# Altium project BatteryCounterRX.PrjPcb
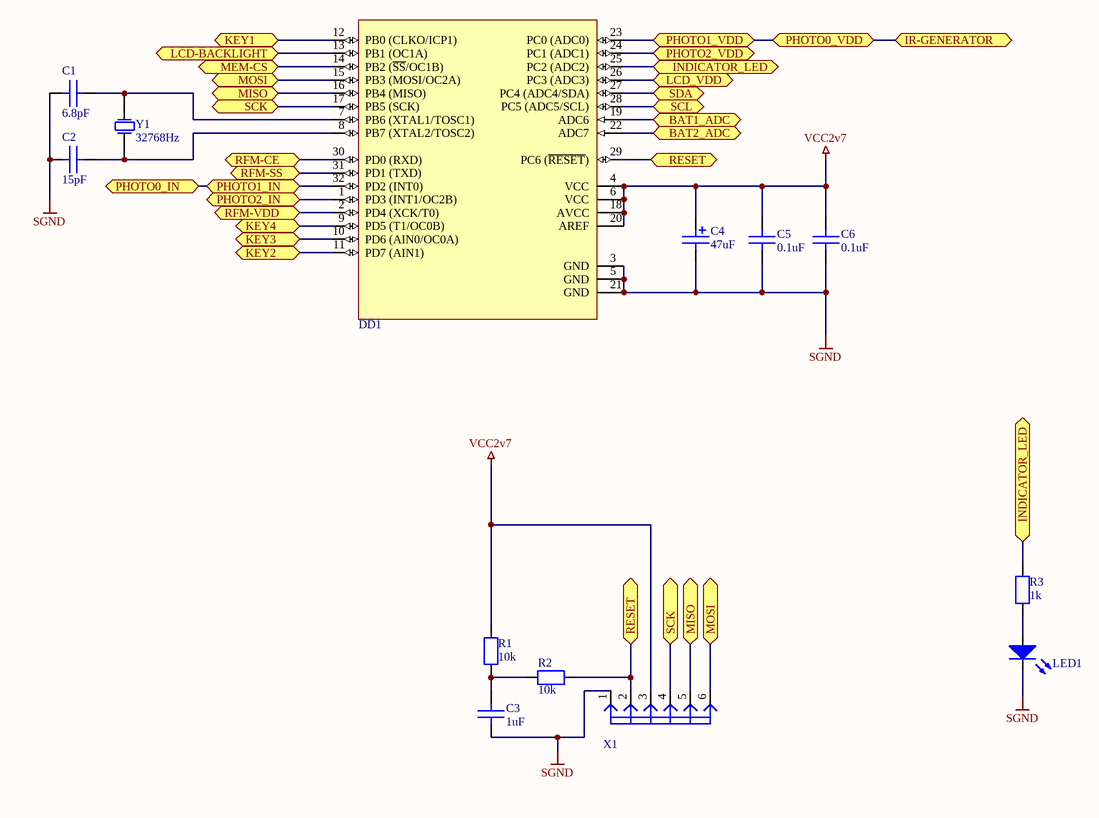
[diagram p0: Micro.SchDoc]
8 sheets, 91 parts. Net scope: global (net labels, ports and power ports of the same name join across sheets).
Board file: BatteryCounterRX.PcbDoc
Sheets:
  Micro.SchDoc
  BattPower.SchDoc
  Memory.SchDoc
  PhotoSensors.SchDoc
  IRGenerator.SchDoc
  KeyBoard.SchDoc
  LCDDisplay.SchDoc
  RFTransceiver.SchDoc

## Sheet Micro.SchDoc
size A4

### Parts
C1  value 6.8pF  [C0805]  (hidden comment: C6.8pF-50V-10%)
C2  value 15pF  [C0805]  (hidden comment: C15pF-50V-10%)
C3  value 1uF  [C0805]  (hidden comment: C1uF-50V)
C4  value 47uF  [TC2917]  (hidden comment: C47uF-10V-tant)
C5  value 0.1uF  [C0805]  (hidden comment: C0.1uF-50V)
C6  value 0.1uF  [C0805]  (hidden comment: C0.1uF-50V)
DD1  ATmega328P  [32A_N]  (value not drawn)
LED1  LED-RED  [LED-3]  (value not drawn)
R1  value 10k  [R0805]  (hidden comment: R10k-5%)
R2  value 10k  [R0805]  (hidden comment: R10k-5%)
R3  value 1k  [R0805]  (hidden comment: R1k-5%)
X1  PLS-6  [PLS-6]  (value not drawn)
Y1  value 32768Hz  [KX38]  (hidden comment: XTAL32768Hz)

### Ports
BAT1_ADC, BAT2_ADC, INDICATOR_LED, IR-GENERATOR, KEY1, KEY2, KEY3, KEY4, LCD-BACKLIGHT, LCD_VDD, MEM-CS, MISO, MOSI, PHOTO0_IN, PHOTO0_VDD, PHOTO1_IN, PHOTO1_VDD, PHOTO2_IN, PHOTO2_VDD, RESET, RFM-CE, RFM-SS, RFM-VDD, SCK, SCL, SDA

### Nets
SGND: C1.1 C2.1 C3.1 C4.2 C5.1 C6.1 DD1.3(GND) DD1.5(GND) DD1.21(GND) LED1.2(K) X1.1
VCC2v7: C4.1 C5.2 C6.2 DD1.4(VCC) DD1.6(VCC) DD1.18(AVCC) DD1.20(AREF) R1.2 X1.3
NetC1_2: C1.2 DD1.7(PB6_(XTAL1/TOSC1)) Y1.2(OSC2)
NetC2_2: C2.2 DD1.8(PB7_(XTAL2/TOSC2)) Y1.1(OSC1)
NetC3_2: C3.2 R1.1 R2.1
NetDD1_1: DD1.1(PD3_(INT1/OC2B)) ; port PHOTO2_IN
NetDD1_2: DD1.2(PD4_(XCK/T0)) ; port RFM-VDD
NetDD1_9: DD1.9(PD5_(T1/OC0B)) ; port KEY4
NetDD1_10: DD1.10(PD6_(AIN0/OC0A)) ; port KEY3
NetDD1_11: DD1.11(PD7_(AIN1)) ; port KEY2
NetDD1_12: DD1.12(PB0_(CLKO/ICP1)) ; port KEY1
NetDD1_13: DD1.13(PB1_(OC1A)) ; port LCD-BACKLIGHT
NetDD1_14: DD1.14(PB2_(~{SS}/OC1B)) ; port MEM-CS
NetDD1_15: DD1.15(PB3_(MOSI/OC2A)) X1.6 ; port MOSI
NetDD1_16: DD1.16(PB4_(MISO)) X1.5 ; port MISO
NetDD1_17: DD1.17(PB5_(SCK)) X1.4 ; port SCK
NetDD1_19: DD1.19(ADC6) ; port BAT1_ADC
NetDD1_22: DD1.22(ADC7) ; port BAT2_ADC
NetDD1_23: DD1.23(PC0_(ADC0)) ; port PHOTO1_VDD, port PHOTO0_VDD, port IR-GENERATOR
NetDD1_24: DD1.24(PC1_(ADC1)) ; port PHOTO2_VDD
NetDD1_25: DD1.25(PC2_(ADC2)) R3.2 ; port INDICATOR_LED
NetDD1_26: DD1.26(PC3_(ADC3)) ; port LCD_VDD
NetDD1_27: DD1.27(PC4_(ADC4/SDA)) ; port SDA
NetDD1_28: DD1.28(PC5_(ADC5/SCL)) ; port SCL
NetDD1_29: DD1.29(PC6_(~{RESET})) R2.2 X1.2 ; port RESET
NetDD1_30: DD1.30(PD0_(RXD)) ; port RFM-CE
NetDD1_31: DD1.31(PD1_(TXD)) ; port RFM-SS
NetDD1_32: DD1.32(PD2_(INT0)) ; port PHOTO1_IN, port PHOTO0_IN
NetLED1_1: LED1.1(A) R3.1

### Library data of the parts
C1 = C6.8pF-50V-10%: Type: Конденсатор керамический; Voltage: 50V; Accuracy: 10%; Name: C6.8pF-50V-10%
C2 = C15pF-50V-10%: Type: Конденсатор керамический; Voltage: 50V; Accuracy: 10%; Name: C15pF-50V-10%
C3 = C1uF-50V: Type: Конденсатор керамический; Voltage: 50V; Name: C1uF-50V
C4 = C47uF-10V-tant: Type: Конденсатор танталовый; Voltage: 10V; Name: C47uF-10V-tant
C5 C6 = C0.1uF-50V: Type: Конденсатор керамический; Voltage: 50V; Name: C0.1uF-50V
DD1 = ATmega328P: 8-Bit AVR Microcontroller with 32K Bytes of In-System Programmable Flash Memory; Name: ATmega328P; Type: Микроконтроллер
LED1 = LED-RED: LED red; Type: Светодиод; Color: Красный; Name: LED-RED
R1 R2 = R10k-5%: R-10k-5%; Precision: 5%; Type: Резистор; Name: R10k-5%
R3 = R1k-5%: R-1k-5%; Precision: 5%; Type: Резистор; Name: R1k-5%
Y1 = XTAL32768Hz: Crystal Oscillator 32768Hz; Name: XTAL32768Hz; Type: Кварц
X1 = PLS-6: Name: PLS-6; Type: Линейка

## Sheet BattPower.SchDoc
size A4
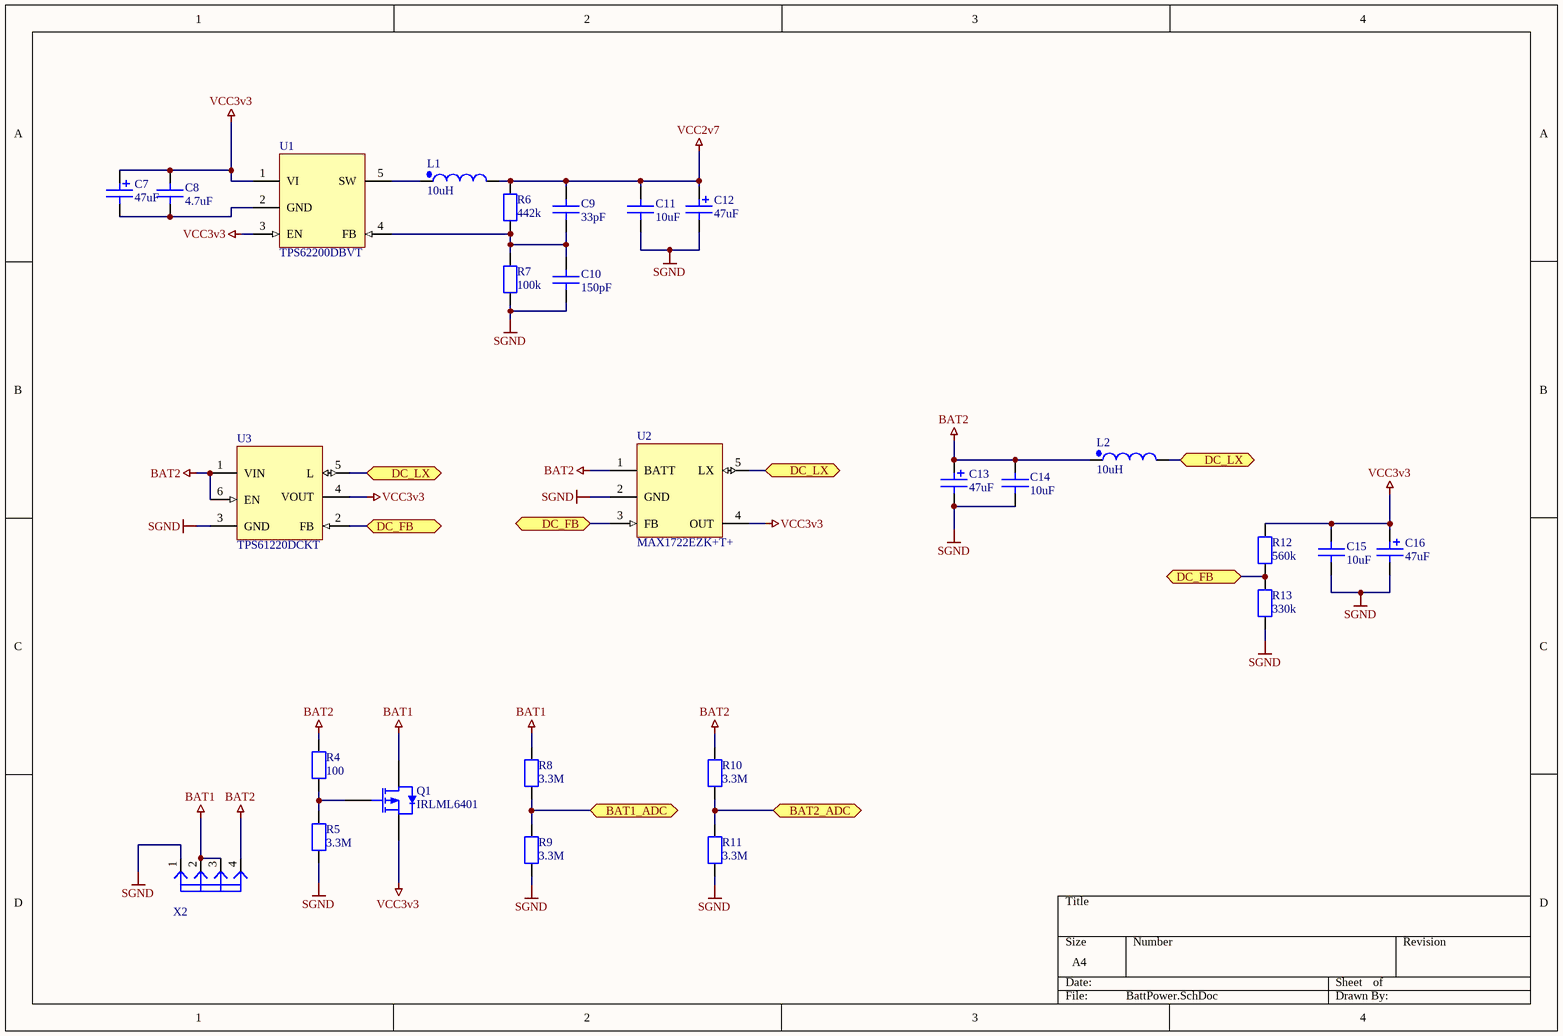
[diagram p1: BattPower.SchDoc]

### Parts
C7  value 47uF  [TC2917]  (hidden comment: C47uF-10V-tant)
C8  value 4.7uF  [C0805]  (hidden comment: C4.7uF-16V)
C9  value 33pF  [C0805]  (hidden comment: C33pF-50V)
C10  value 150pF  [C0805]  (hidden comment: C150pF-50V)
C11  value 10uF  [C0805]  (hidden comment: C10uF-16V)
C12  value 47uF  [TC2917]  (hidden comment: C47uF-10V-tant)
C13  value 47uF  [TC2917]  (hidden comment: C47uF-10V-tant)
C14  value 10uF  [C0805]  (hidden comment: C10uF-16V)
C15  value 10uF  [C0805]  (hidden comment: C10uF-16V)
C16  value 47uF  [TC2917]  (hidden comment: C47uF-10V-tant)
L1  value 10uH  [CD54-CDRH4D]  (hidden comment: CD54)
L2  value 10uH  [CD54-CDRH4D]  (hidden comment: CD54)
Q1  IRLML6401  [SOT23_N]
R4  value 100  [R0805]  (hidden comment: R100-5%)
R5  value 3.3M  [R0805]  (hidden comment: R3.3M-5%)
R6  value 442k  [R0805]  (hidden comment: R442k-1%)
R7  value 100k  [R0805]  (hidden comment: R100k-1%)
R8  value 3.3M  [R0805]  (hidden comment: R3.3M-5%)
R9  value 3.3M  [R0805]  (hidden comment: R3.3M-5%)
R10  value 3.3M  [R0805]  (hidden comment: R3.3M-5%)
R11  value 3.3M  [R0805]  (hidden comment: R3.3M-5%)
R12  value 560k  [R0805]  (hidden comment: R560k-1%)
R13  value 330k  [R0805]  (hidden comment: R330k-1%)
U1  TPS62200DBVT  [5ST1_N]
U2  MAX1722EZK+T+  [5ST1_N]
U3  TPS61220DCKT  [SC70-6-N]
X2  PLS-4  [PLS-4]  (value not drawn)

### Ports
BAT1_ADC, BAT2_ADC, DC_FB, DC_LX

### Nets
BAT1: Q1.3(D) R8.2 X2.2 X2.3
BAT2: C13.1 C14.2 L2.1 R4.2 R10.2 U2.1(BATT) U3.1(VIN) U3.6(EN) X2.4
SGND: C10.1 C11.1 C12.2 C13.2 C14.1 C15.1 C16.2 R5.1 R7.1 R9.1 R11.1 R13.1 U2.2(GND) U3.3(GND) X2.1
VCC2v7: C9.2 C11.2 C12.1 L1.2 R6.2
VCC3v3: C7.1 C8.2 C15.2 C16.1 Q1.2(S) R12.2 U1.1(VI) U1.3(EN) U2.4(OUT) U3.4(VOUT)
NetC7_2: C7.2 C8.1 U1.2(GND)
NetC9_1: C9.1 C10.2 R6.1 R7.2 U1.4(FB)
NetDD1_19: R8.1 R9.2 ; port BAT1_ADC
NetDD1_22: R10.1 R11.2 ; port BAT2_ADC
NetL1_1: L1.1 U1.5(SW)
NetL2_2: L2.2 U2.5(LX) U3.5(L) ; port DC_LX
NetQ1_1: Q1.1(G) R4.1 R5.2
NetR12_1: R12.1 R13.2 U2.3(FB) U3.2(FB) ; port DC_FB

### Library data of the parts
C7 C12 C13 C16 = C47uF-10V-tant: as C4 on sheet Micro; Name: C47uF-10V-tant
C8 = C4.7uF-16V: Type: Конденсатор керамический; Voltage: 16V; Name: C4.7uF-16V
C9 = C33pF-50V: Type: Конденсатор керамический; Voltage: 50V; Name: C33pF-50V
C10 = C150pF-50V: Type: Конденсатор керамический; Voltage: 50V; Name: C150pF-50V
C11 C14 C15 = C10uF-16V: Type: Конденсатор керамический; Voltage: 16V; Name: C10uF-16V
L1 L2 = CD54NP-100M: Inductor with Winding Polarity Marking; Current: 1.44A; Type: Дроссель; Name: CD54
Q1 = IRLML6401: P-Channel Power MOSFET; Type: MOSFET P-канал; Vds: 12V; Id: 4.3A; Vgs: 0.4-0.95V; Name: IRLML6401
R4 = R100-5%: R-100-5%; Precision: 5%; Type: Резистор; Name: R100-5%
R5 R8-R11 = R3.3M-5%: Precision: 5%; Type: Резистор; Name: R3.3M-5%
R6 = R442k-1%: Precision: 1%; Type: Резистор; Name: R442k-1%
R7 = R100k-1%: Precision: 1%; Type: Резистор; Name: R100k-1%
R12 = R560k-1%: Precision: 1%; Type: Резистор; Name: R560k-1%
R13 = R330k-1%: Precision: 1%; Type: Резистор; Name: R330k-1%
U1 = TPS62200DBVT: High efficiency step-down DC-DC convertor, 5-pin SOT23; Name: TPS62200DBVT; Type: DC-DC конвертор понижающий
U2 = MAX1722EZK+T+: High efficiency step-down DC-DC convertor, 5-pin SOT23; Name: MAX1722EZK+T+; Type: DC-DC конвертор повышающий
U3 = TPS61220DCKT: Low input voltage step-up DC-DC convertor, 6-pin SC70; Name: TPS61220DCKT; Type: DC-DC конвертор повышающий
X2 = PLS-4: Name: PLS-4; Type: Линейка

## Sheet Memory.SchDoc
size A4
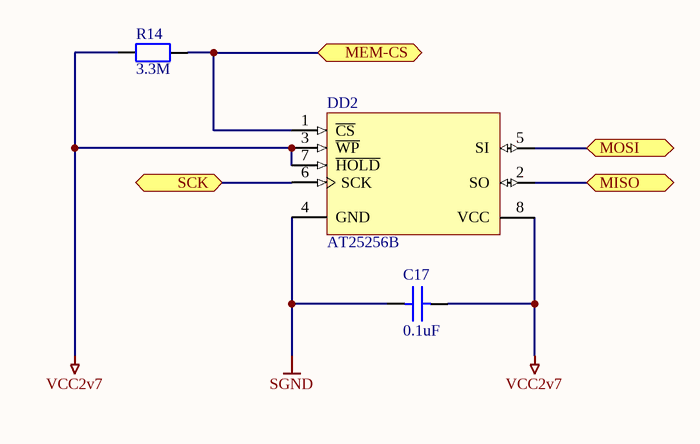
[diagram p2: Memory.SchDoc]

### Parts
C17  value 0.1uF  [C0805]  (hidden comment: C0.1uF-50V)
DD2  AT25256B  [8S12_UNIV]
R14  value 3.3M  [R0805]  (hidden comment: R3.3M-5%)

### Ports
MEM-CS, MISO, MOSI, SCK

### Nets
SGND: C17.1 DD2.4(GND)
VCC2v7: C17.2 DD2.3(~{WP}) DD2.7(~{HOLD}) DD2.8(VCC) R14.1
NetDD1_14: DD2.1(~{CS}) R14.2 ; port MEM-CS
NetDD1_15: DD2.5(SI) ; port MOSI
NetDD1_16: DD2.2(SO) ; port MISO
NetDD1_17: DD2.6(SCK) ; port SCK

### Library data of the parts
C17 = C0.1uF-50V: as C5 on sheet Micro; Name: C0.1uF-50V
DD2 = AT25256B: SPI Serial EEPROM 256K Memory; Name: AT25256B; Type: Память
R14 = R3.3M-5%: Precision: 5%; Type: Резистор; Name: R3.3M-5%

## Sheet PhotoSensors.SchDoc
size A4
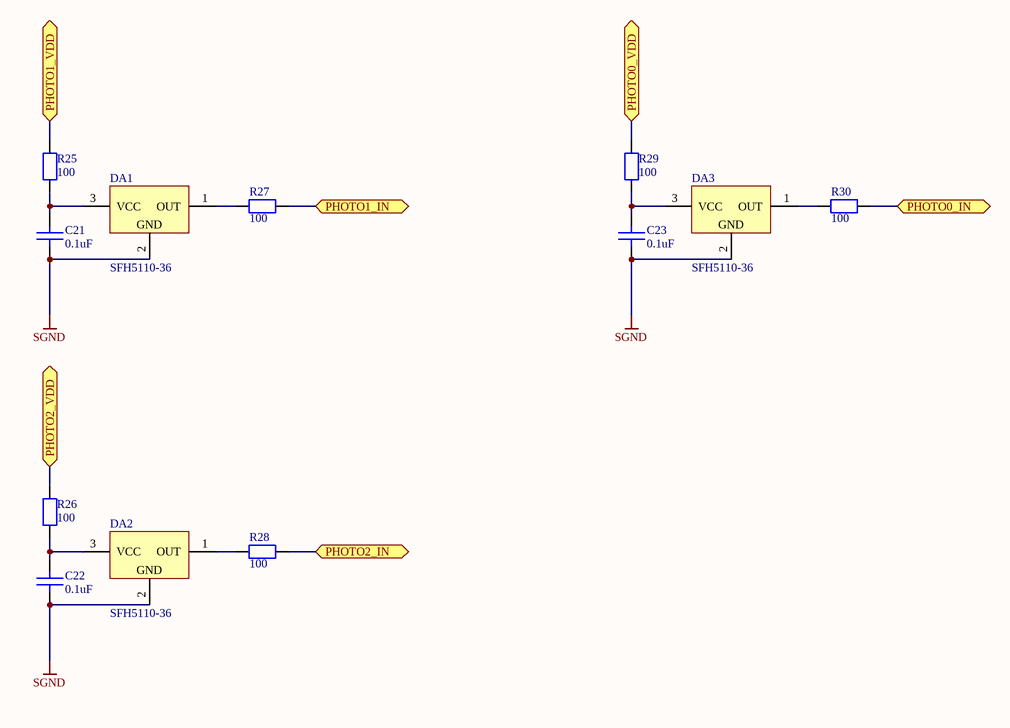
[diagram p3: PhotoSensors.SchDoc]

### Parts
C21  value 0.1uF  [C0805]  (hidden comment: C0.1uF-50V)
C22  value 0.1uF  [C0805]  (hidden comment: C0.1uF-50V)
C23  value 0.1uF  [C0805]  (hidden comment: C0.1uF-50V)
DA1  SFH5110-36  [SFH5110]
DA2  SFH5110-36  [SFH5110]
DA3  SFH5110-36  [SFH5110]
R25  value 100  [R0805]  (hidden comment: R100-5%)
R26  value 100  [R0805]  (hidden comment: R100-5%)
R27  value 100  [R0805]  (hidden comment: R100-5%)
R28  value 100  [R0805]  (hidden comment: R100-5%)
R29  value 100  [R0805]  (hidden comment: R100-5%)
R30  value 100  [R0805]  (hidden comment: R100-5%)

### Ports
PHOTO0_IN, PHOTO0_VDD, PHOTO1_IN, PHOTO1_VDD, PHOTO2_IN, PHOTO2_VDD

### Nets
SGND: C21.1 C22.1 C23.1 DA1.2(GND) DA2.2(GND) DA3.2(GND)
NetC21_2: C21.2 DA1.3(VCC) R25.1
NetC22_2: C22.2 DA2.3(VCC) R26.1
NetC23_2: C23.2 DA3.3(VCC) R29.1
NetDA1_1: DA1.1(OUT) R27.2
NetDA2_1: DA2.1(OUT) R28.2
NetDA3_1: DA3.1(OUT) R30.2
NetDD1_1: R28.1 ; port PHOTO2_IN
NetDD1_23: R25.2 R29.2 ; port PHOTO1_VDD, port PHOTO0_VDD
NetDD1_24: R26.2 ; port PHOTO2_VDD
NetDD1_32: R27.1 R30.1 ; port PHOTO1_IN, port PHOTO0_IN

### Library data of the parts
C21-C23 = C0.1uF-50V: as C5 on sheet Micro; Name: C0.1uF-50V
DA1-DA3 = SFH5110-36: IR-Receiver; Value: 36kHz; Name: SFH5110-36; Type: ИК-приемник
R25-R30 = R100-5%: R-100-5%; Precision: 5%; Type: Резистор; Name: R100-5%

## Sheet IRGenerator.SchDoc
size A4
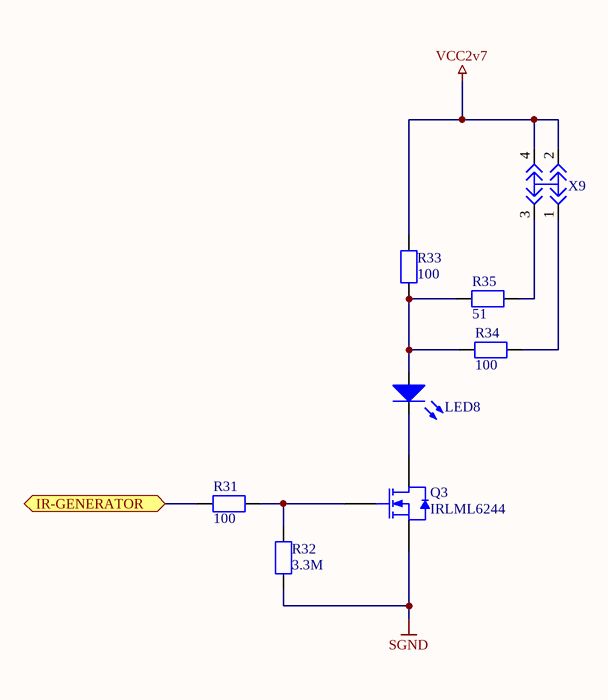
[diagram p4: IRGenerator.SchDoc]

### Parts
LED8  L53F3C  [LED-5-SHORT-LEGS]  (value not drawn)
Q3  IRLML6244  [SOT23_N]
R31  value 100  [R0805]  (hidden comment: R100-5%)
R32  value 3.3M  [R0805]  (hidden comment: R3.3M-5%)
R33  value 100  [R1206]  (hidden comment: R100-5%)
R34  value 100  [R1206]  (hidden comment: R100-5%)
R35  value 51  [R1206]  (hidden comment: R51-5%)
X9  JUMPER-PLD-POWER-0-1-2  [PLD-POWER-1-2-3]  (value not drawn)

### Ports
IR-GENERATOR

### Nets
SGND: Q3.2(S) R32.2
VCC2v7: R33.2 X9.2 X9.4
NetDD1_23: R31.1 ; port IR-GENERATOR
NetLED8_1: LED8.1(A) R33.1 R34.2 R35.2
NetLED8_2: LED8.2(K) Q3.3(D)
NetQ3_1: Q3.1(G) R31.2 R32.1
NetR34_1: R34.1 X9.1
NetR35_1: R35.1 X9.3

### Library data of the parts
LED8 = L53F3C: IR LED; Type: Светодиод; Color: IR; Name: L53F3C
Q3 = IRLML6244: N-Channel Power MOSFET; Type: MOSFET N-канал; Id: 6.3A; Vgs: 0.5-11V; Vds: 20V; Name: IRLML6244
R31 R33 R34 = R100-5%: R-100-5%; Precision: 5%; Type: Резистор; Name: R100-5%
R32 = R3.3M-5%: Precision: 5%; Type: Резистор; Name: R3.3M-5%
R35 = R51-5%: R-51-5%; Precision: 5%; Type: Резистор; Name: R51-5%
X9 = JUMPER-PLD-POWER-0-1-2: Name: JUMPER-PLD-POWER-0-1-2; Type: Линейка джамперов

## Sheet KeyBoard.SchDoc
size A4
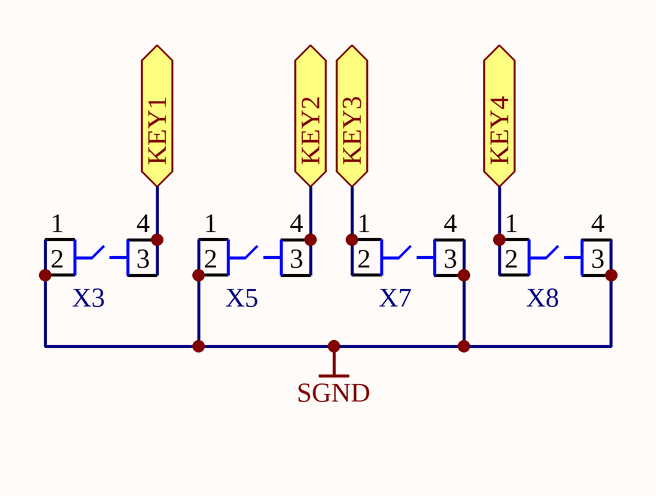
[diagram p5: KeyBoard.SchDoc]

### Parts
X3  TACT0606  [TACT0606]  (value not drawn)
X5  TACT0606  [TACT0606]  (value not drawn)
X7  TACT0606  [TACT0606]  (value not drawn)
X8  TACT0606  [TACT0606]  (value not drawn)

### Ports
KEY1, KEY2, KEY3, KEY4

### Nets
SGND: X3.1 X3.2 X5.1 X5.2 X7.3 X7.4 X8.3 X8.4
NetDD1_9: X8.1 X8.2 ; port KEY4
NetDD1_10: X7.1 X7.2 ; port KEY3
NetDD1_11: X5.3 X5.4 ; port KEY2
NetDD1_12: X3.3 X3.4 ; port KEY1

### Library data of the parts
X3 X5 X7 X8 = TACT0606: Tact switch 6x6mm; Name: TACT0606; Type: Кнопка

## Sheet LCDDisplay.SchDoc
size A4
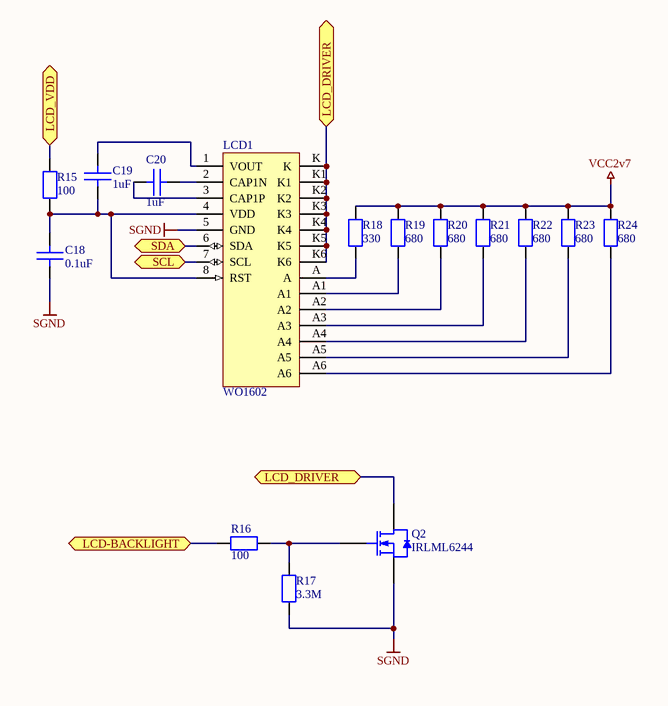
[diagram p6: LCDDisplay.SchDoc]

### Parts
C18  value 0.1uF  [C0805]  (hidden comment: C0.1uF-50V)
C19  value 1uF  [C0805]  (hidden comment: C1uF-50V)
C20  value 1uF  [C0805]  (hidden comment: C1uF-50V)
LCD1  WO1602  [WO1602I]
Q2  IRLML6244  [SOT23_N]
R15  value 100  [R0805]  (hidden comment: R100-5%)
R16  value 100  [R0805]  (hidden comment: R100-5%)
R17  value 3.3M  [R0805]  (hidden comment: R3.3M-5%)
R18  value 330  [R1206]  (hidden comment: R330-5%)
R19  value 680  [R1206]  (hidden comment: R680-5%)
R20  value 680  [R1206]  (hidden comment: R680-5%)
R21  value 680  [R1206]  (hidden comment: R680-5%)
R22  value 680  [R1206]  (hidden comment: R680-5%)
R23  value 680  [R1206]  (hidden comment: R680-5%)
R24  value 680  [R1206]  (hidden comment: R680-5%)

### Ports
LCD-BACKLIGHT, LCD_DRIVER, LCD_VDD, SCL, SDA

### Nets
SGND: C18.1 LCD1.5(GND) Q2.2(S) R17.2
VCC2v7: R18.2 R19.2 R20.2 R21.2 R22.2 R23.1 R24.2
NetC18_2: C18.2 C19.2 LCD1.4(VDD) LCD1.8(RST) R15.1
NetC19_1: C19.1 LCD1.1(VOUT)
NetC20_1: C20.1 LCD1.2(CAP1N)
NetC20_2: C20.2 LCD1.3(CAP1P)
NetDD1_13: R16.1 ; port LCD-BACKLIGHT
NetDD1_26: R15.2 ; port LCD_VDD
NetDD1_27: LCD1.6(SDA) ; port SDA
NetDD1_28: LCD1.7(SCL) ; port SCL
NetLCD1_A: LCD1.A R18.1
NetLCD1_A1: LCD1.A1 R19.1
NetLCD1_A2: LCD1.A2 R20.1
NetLCD1_A3: LCD1.A3 R21.1
NetLCD1_A4: LCD1.A4 R22.1
NetLCD1_A5: LCD1.A5 R23.2
NetLCD1_A6: LCD1.A6 R24.1
NetLCD1_K: LCD1.K LCD1.K1 LCD1.K2 LCD1.K3 LCD1.K4 LCD1.K5 LCD1.K6 Q2.3(D) ; port LCD_DRIVER
NetQ2_1: Q2.1(G) R16.2 R17.1

### Library data of the parts
C18 = C0.1uF-50V: as C5 on sheet Micro; Name: C0.1uF-50V
C19 C20 = C1uF-50V: as C3 on sheet Micro; Name: C1uF-50V
LCD1 = WO1602: LCD COG display 16x02; Name: WO1602; Type: LCD COG дисплей
Q2 = IRLML6244: as Q3 on sheet IRGenerator; Name: IRLML6244
R15 R16 = R100-5%: R-100-5%; Precision: 5%; Type: Резистор; Name: R100-5%
R17 = R3.3M-5%: Precision: 5%; Type: Резистор; Name: R3.3M-5%
R18 = R330-5%: R-330-5%; Precision: 5%; Type: Резистор; Name: R330-5%
R19-R24 = R680-5%: R-680-5%; Precision: 5%; Type: Резистор; Name: R680-5%

## Sheet RFTransceiver.SchDoc
size A4
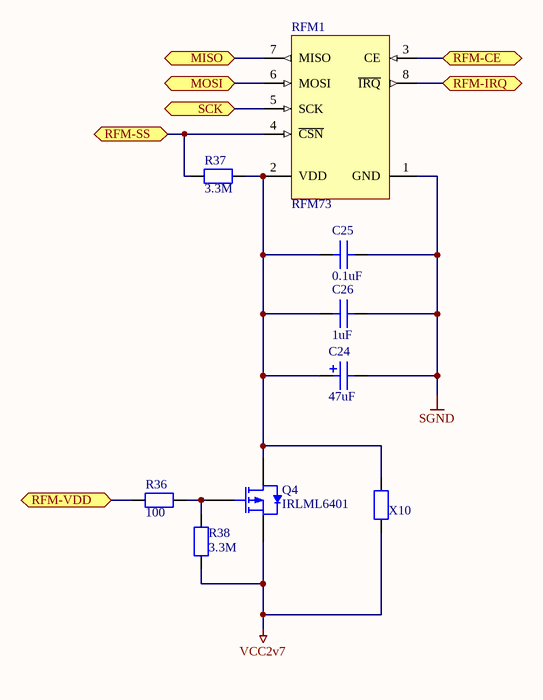
[diagram p7: RFTransceiver.SchDoc]

### Parts
C24  value 47uF  [TC2917]  (hidden comment: C47uF-10V-tant)
C25  value 0.1uF  [C0805]  (hidden comment: C0.1uF-50V)
C26  value 1uF  [C0805]  (hidden comment: C1uF-50V)
Q4  IRLML6401  [SOT23_N]
R36  value 100  [R0805]  (hidden comment: R100-5%)
R37  value 3.3M  [R0805]  (hidden comment: R3.3M-5%)
R38  value 3.3M  [R0805]  (hidden comment: R3.3M-5%)
RFM1  RFM73  [RFM73-SML]
X10  JUMPER0  [R0805]  (value not drawn)

### Ports
MISO, MOSI, RFM-CE, RFM-IRQ, RFM-SS, RFM-VDD, SCK

### Nets
SGND: C24.2 C25.2 C26.2 RFM1.1(GND)
VCC2v7: Q4.2(S) R38.2 X10.1
NetC24_1: C24.1 C25.1 C26.1 Q4.3(D) R37.1 RFM1.2(VDD) X10.2
NetDD1_2: R36.1 ; port RFM-VDD
NetDD1_15: RFM1.6(MOSI) ; port MOSI
NetDD1_16: RFM1.7(MISO) ; port MISO
NetDD1_17: RFM1.5(SCK) ; port SCK
NetDD1_30: RFM1.3(CE) ; port RFM-CE
NetDD1_31: R37.2 RFM1.4(~{CSN}) ; port RFM-SS
NetQ4_1: Q4.1(G) R36.2 R38.1
NetRFM1_8: RFM1.8(~{IRQ}) ; port RFM-IRQ

### Library data of the parts
C24 = C47uF-10V-tant: as C4 on sheet Micro; Name: C47uF-10V-tant
C25 = C0.1uF-50V: as C5 on sheet Micro; Name: C0.1uF-50V
C26 = C1uF-50V: as C3 on sheet Micro; Name: C1uF-50V
Q4 = IRLML6401: as Q1 on sheet BattPower; Name: IRLML6401
R36 = R100-5%: R-100-5%; Precision: 5%; Type: Резистор; Name: R100-5%
R37 R38 = R3.3M-5%: Precision: 5%; Type: Резистор; Name: R3.3M-5%
RFM1 = RFM73: 2.4GHz GFSK Transceiver; Name: RFM73; Type: Радиомодуль 2.4 ГГц
X10 = JUMPER0: Type: Перемычка; Name: JUMPER0

## Nets that join several sheets
SGND: Micro (11 pins), BattPower (15 pins), Memory (C17.1 DD2.4), PhotoSensors (6 pins), IRGenerator (Q3.2 R32.2), KeyBoard (8 pins), LCDDisplay (C18.1 LCD1.5 Q2.2 R17.2), RFTransceiver (C24.2 C25.2 C26.2 RFM1.1)
VCC2v7: Micro (9 pins), BattPower (5 pins), Memory (5 pins), IRGenerator (R33.2 X9.2 X9.4), LCDDisplay (7 pins), RFTransceiver (Q4.2 R38.2 X10.1)
NetDD1_1: Micro (DD1.1), PhotoSensors (R28.1)
NetDD1_2: Micro (DD1.2), RFTransceiver (R36.1)
NetDD1_9: Micro (DD1.9), KeyBoard (X8.1 X8.2)
NetDD1_10: Micro (DD1.10), KeyBoard (X7.1 X7.2)
NetDD1_11: Micro (DD1.11), KeyBoard (X5.3 X5.4)
NetDD1_12: Micro (DD1.12), KeyBoard (X3.3 X3.4)
NetDD1_13: Micro (DD1.13), LCDDisplay (R16.1)
NetDD1_14: Micro (DD1.14), Memory (DD2.1 R14.2)
NetDD1_15: Micro (DD1.15 X1.6), Memory (DD2.5), RFTransceiver (RFM1.6)
NetDD1_16: Micro (DD1.16 X1.5), Memory (DD2.2), RFTransceiver (RFM1.7)
NetDD1_17: Micro (DD1.17 X1.4), Memory (DD2.6), RFTransceiver (RFM1.5)
NetDD1_19: Micro (DD1.19), BattPower (R8.1 R9.2)
NetDD1_22: Micro (DD1.22), BattPower (R10.1 R11.2)
NetDD1_23: Micro (DD1.23), PhotoSensors (R25.2 R29.2), IRGenerator (R31.1)
NetDD1_24: Micro (DD1.24), PhotoSensors (R26.2)
NetDD1_26: Micro (DD1.26), LCDDisplay (R15.2)
NetDD1_27: Micro (DD1.27), LCDDisplay (LCD1.6)
NetDD1_28: Micro (DD1.28), LCDDisplay (LCD1.7)
NetDD1_30: Micro (DD1.30), RFTransceiver (RFM1.3)
NetDD1_31: Micro (DD1.31), RFTransceiver (R37.2 RFM1.4)
NetDD1_32: Micro (DD1.32), PhotoSensors (R27.1 R30.1)